# Altium schematic sheet MCU.SchDoc
size A4; SheetNumber: 2; SheetTotal: 2
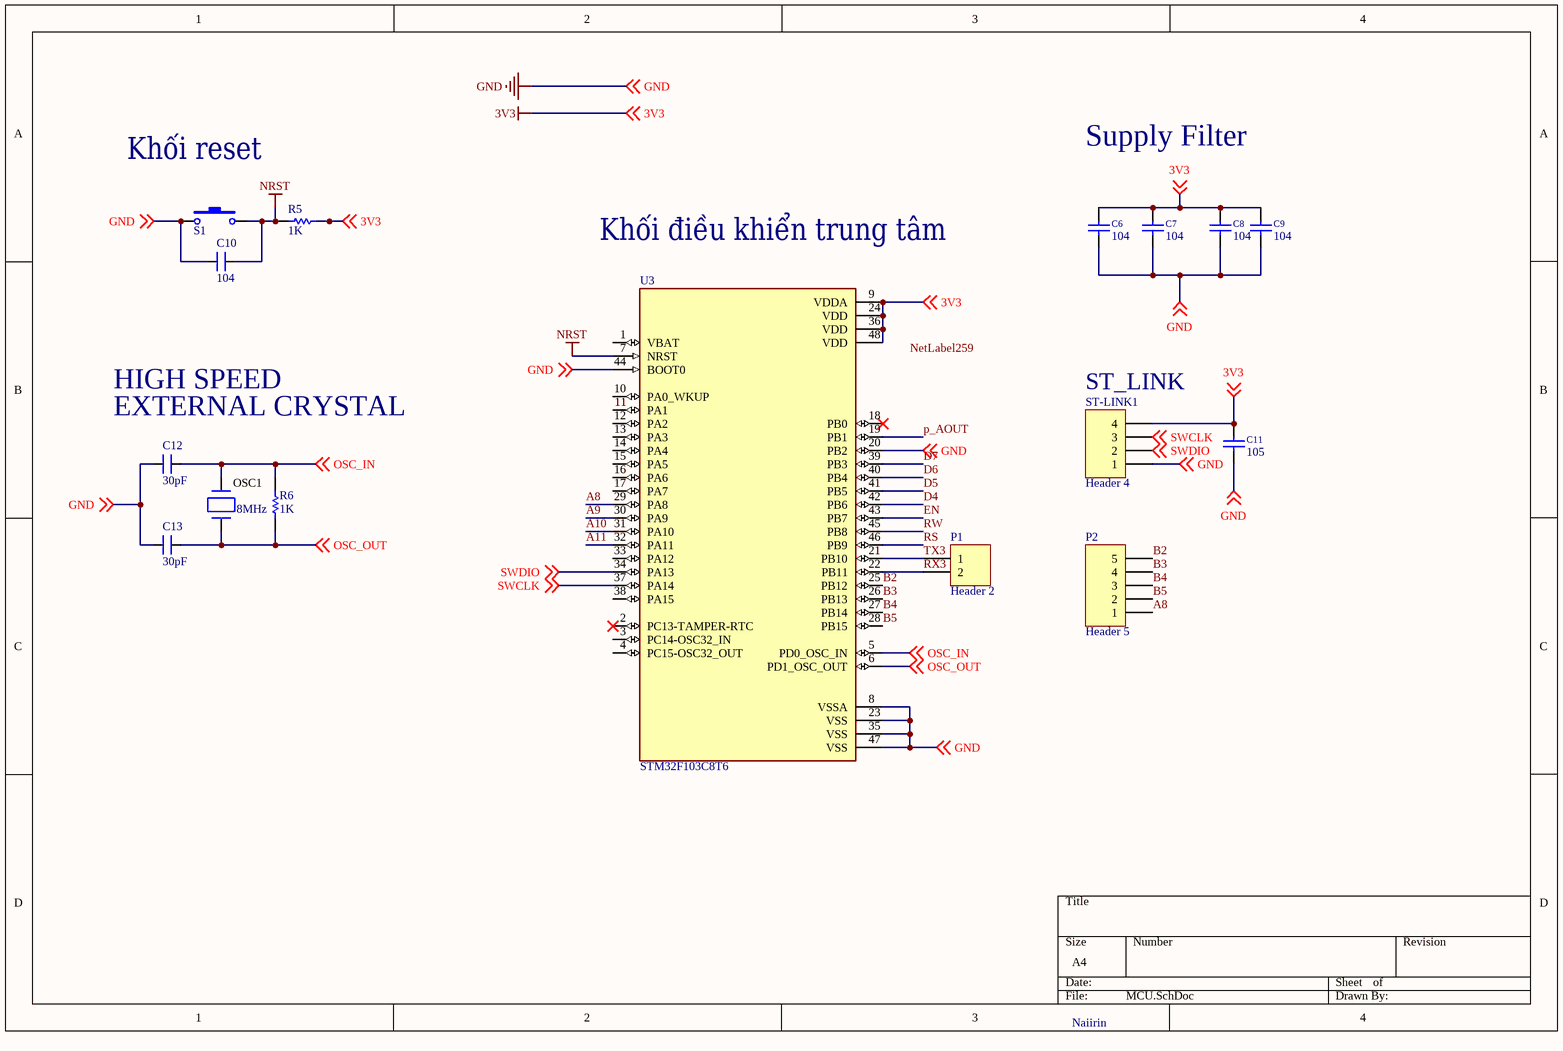
[diagram p0: MCU.SchDoc]

## Parts
C6  104  [C1608-0603]
C7  104  [C1608-0603]
C8  104  [C1608-0603]
C9  104  [C1608-0603]
C10  104  [SM-0805]
C11  105  [C1608-0603]
C12  30pF  [SM-0805]
C13  30pF  [SM-0805]
OSC1  value 8MHz  [Crystal.HC49/USxx]  (hidden comment: Crystal2)
P1  Header 2  [Header 2]
P2  Header 5  [Header 5]
R5  value 1K  [R-0805]  (hidden comment: RESISTOR)
R6  value 1K  [R-0805]  (hidden comment: RESISTOR)
S1  SW-SMD  [SW-SMD]  (value not drawn)
ST-LINK1  Header 4  [Header 4]
U3  STM32F103C8T6  [QFP50P900X900X160-48N]

## Nets
3V3: C6.2 C7.2 C8.2 C9.2 C11.2 R5.2 ST-LINK1.4 U3.9(VDDA) U3.24(VDD) U3.36(VDD) U3.48(VDD) ; off-sheet 3V3
GND: C6.1 C7.1 C8.1 C9.1 C10.1 C11.1 C12.1 C13.1 S1.1 ST-LINK1.1 U3.8(VSSA) U3.20(PB2) U3.23(VSS) U3.35(VSS) U3.44(BOOT0) U3.47(VSS) ; off-sheet GND
NRST: C10.2 R5.1 S1.2 U3.7(NRST)
A8: P2.1 U3.29(PA8)
A9: U3.30(PA9)
A10: U3.31(PA10)
A11: U3.32(PA11)
B2: P2.5 U3.25(PB12)
B3: P2.4 U3.26(PB13)
B4: P2.3 U3.27(PB14)
B5: P2.2 U3.28(PB15)
D4: U3.42(PB6)
D5: U3.41(PB5)
D6: U3.40(PB4)
D7: U3.39(PB3)
EN: U3.43(PB7)
OSC_IN: C12.2 OSC1.1 R6.2 U3.5(PD0_OSC_IN) ; off-sheet OSC_IN
OSC_OUT: C13.2 OSC1.2 R6.1 U3.6(PD1_OSC_OUT) ; off-sheet OSC_OUT
p_AOUT: U3.19(PB1)
RS: U3.46(PB9)
RW: U3.45(PB8)
RX3: P1.2 U3.22(PB11)
SWCLK: ST-LINK1.3 U3.37(PA14) ; off-sheet SWCLK
SWDIO: ST-LINK1.2 U3.34(PA13) ; off-sheet SWDIO
TX3: P1.1 U3.21(PB10)

Not connected (* = marked no-connect by the designer): U3 1(VBAT) 2(PC13-TAMPER-RTC)* 3(PC14-OSC32_IN) 4(PC15-OSC32_OUT) 10(PA0_WKUP) 11(PA1) 12(PA2) 13(PA3) 14(PA4) 15(PA5) 16(PA6) 17(PA7) 18(PB0)* 33(PA12) 38(PA15)

## Notes on the sheet
- Khối reset
- Supply Filter
- Khối điều khiển trung tâm
- HIGH SPEED
- (near C12) EXTERNAL CRYSTAL
- (near ST-LINK1) ST_LINK
- Naiirin
- Labels drawn without touching a wire or pin: NetLabel259

## Library data of the parts
C6-C9 C11 = Capacitor: AEMS Code: 2100341; Vendor: Digikey; Volt: 16V; Published: 13-April-2009; Publisher: Hoang Nguyen; ComponentLink1Description: Digikey Part Link; ComponentLink2Description: Open Datasheet; ComponentLink2URL: H:\LIBRARY\LIBRARY.Datasheet\
  C6-C9: Value: 104
  C11: Value: 105
C10 C12 C13 = CM: Cap SMD; Value: 103
OSC1 = Crystal2: Quarz Crystal; Vendor: Digikey; Published: 13-April-2009; Publisher: Hoang Nguyen; ComponentLink1Description: Digikey Part Link; ComponentLink2Description: Open Datasheet; ComponentLink2URL: H:\LIBRARY\LIBRARY.Datasheet\; Price: 2000 VND
P1 = Header 2: Header, 2-Pin; LatestRevisionDate: 17-Jul-2002; LatestRevisionNote: Re-released for DXP Platform.; Publisher: Altium Limited
P2 = Header 5: Header, 5-Pin; LatestRevisionDate: 17-Jul-2002; LatestRevisionNote: Re-released for DXP Platform.; Publisher: Altium Limited
S1 = SW-SMD: Switch; Published: 24-Mar-1999; LatestRevisionDate: 17-Jul-2002; LatestRevisionNote: Re-released for DXP Platform.; PackageReference: SPST-2; Publisher: Altium Limited
ST-LINK1 = Header 4: Header, 4-Pin; LatestRevisionDate: 17-Jul-2002; LatestRevisionNote: Re-released for DXP Platform.; Publisher: Altium Limited
U3 = STM32F103C8T6: ARMÂ® CortexÂ®-M3 STM32F1 Microcontroller IC 32-Bit 72MHz 64KB (64K x 8) FLASH 48-LQFP (7x7); MF: STMicroelectronics; Package: LQFP-48 STMicroelectronics; Price: None; Check_prices: https://www.snapeda.com/parts/STM32F103C8T6/STMicroelectronics/view-part/?ref=eda; Value: *; SnapEDA_Link: https://www.snapeda.com/parts/STM32F103C8T6/STMicroelectronics/view-part/?ref=snap; MP: STM32F103C8T6; Availability: In Stock; Purchase-URL: https://pricing.snapeda.com/search/part/STM32F103C8T6/?ref=eda
R5 R6 = RESISTOR: Published: 8-Jun-2000; LatestRevisionDate: 17-Jul-2002; LatestRevisionNote: Re-released for DXP Platform.; PackageReference: AXIAL-0.3; Publisher: Altium Limited